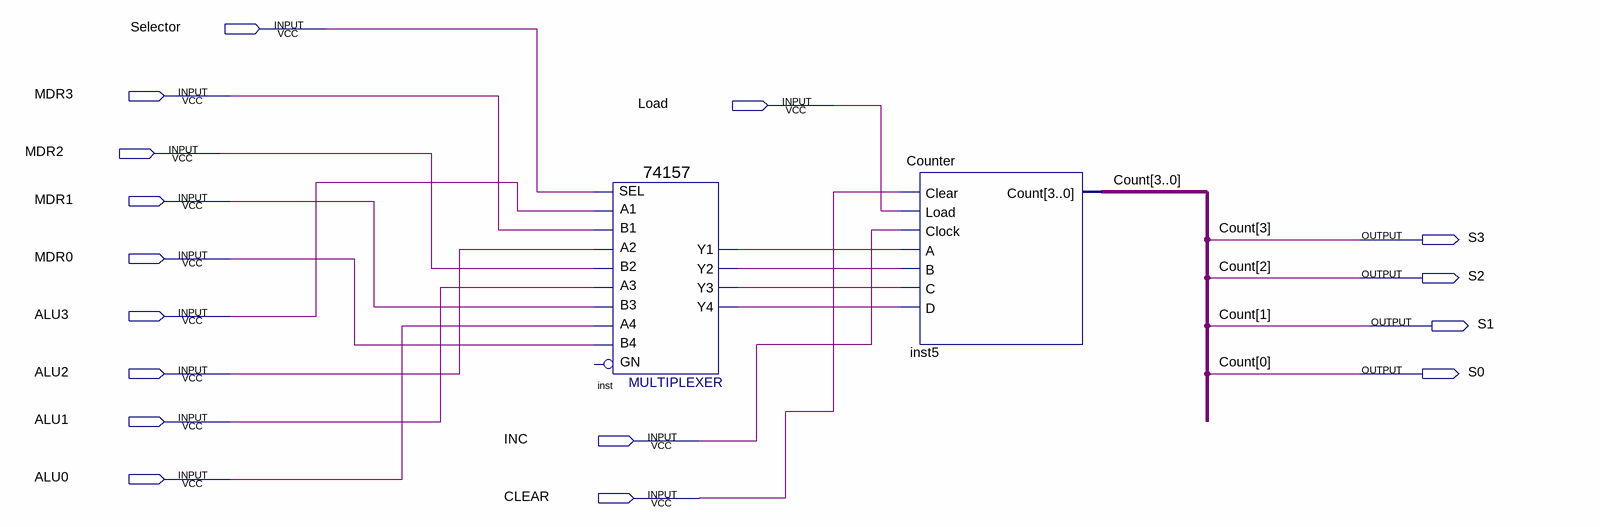
[diagram p0: schematic sheet]
// Quartus schematic ACC.bdf as structural Verilog: 2 symbols, 16 pins
module ACC (
  input  Selector,
  input  MDR3,
  input  Load,
  input  MDR2,
  input  MDR1,
  input  MDR0,
  input  ALU3,
  input  ALU2,
  input  ALU1,
  input  INC,
  input  ALU0,
  input  CLEAR,
  output S3,
  output S2,
  output S1,
  output S0
);

  wire inst_y1, inst_y2, inst_y3, inst_y4;

  \74157  inst (
    .A1(ALU3), .B1(MDR3), .SEL(Selector), .B2(MDR2), .A3(ALU1), .B3(MDR1), .A2(ALU2), .B4(MDR0), .A4(ALU0),
    .Y2(inst_y2), .Y1(inst_y1), .Y4(inst_y4), .Y3(inst_y3));  // open: GN
  Counter inst5 (
    .Clear(CLEAR), .Load(Load), .Clock(INC), .A(inst_y1), .B(inst_y2), .C(inst_y3), .D(inst_y4),
    .Count({S3, S2, S1, S0}));

  // Other names for the same wires on the sheet: Count[3:0] = {S3, S2, S1, S0}
endmodule
